# Altium schematic sheet CANTRICK PERIPHERAL.SchDoc
size A4; SheetNumber: 5; SheetTotal: 5
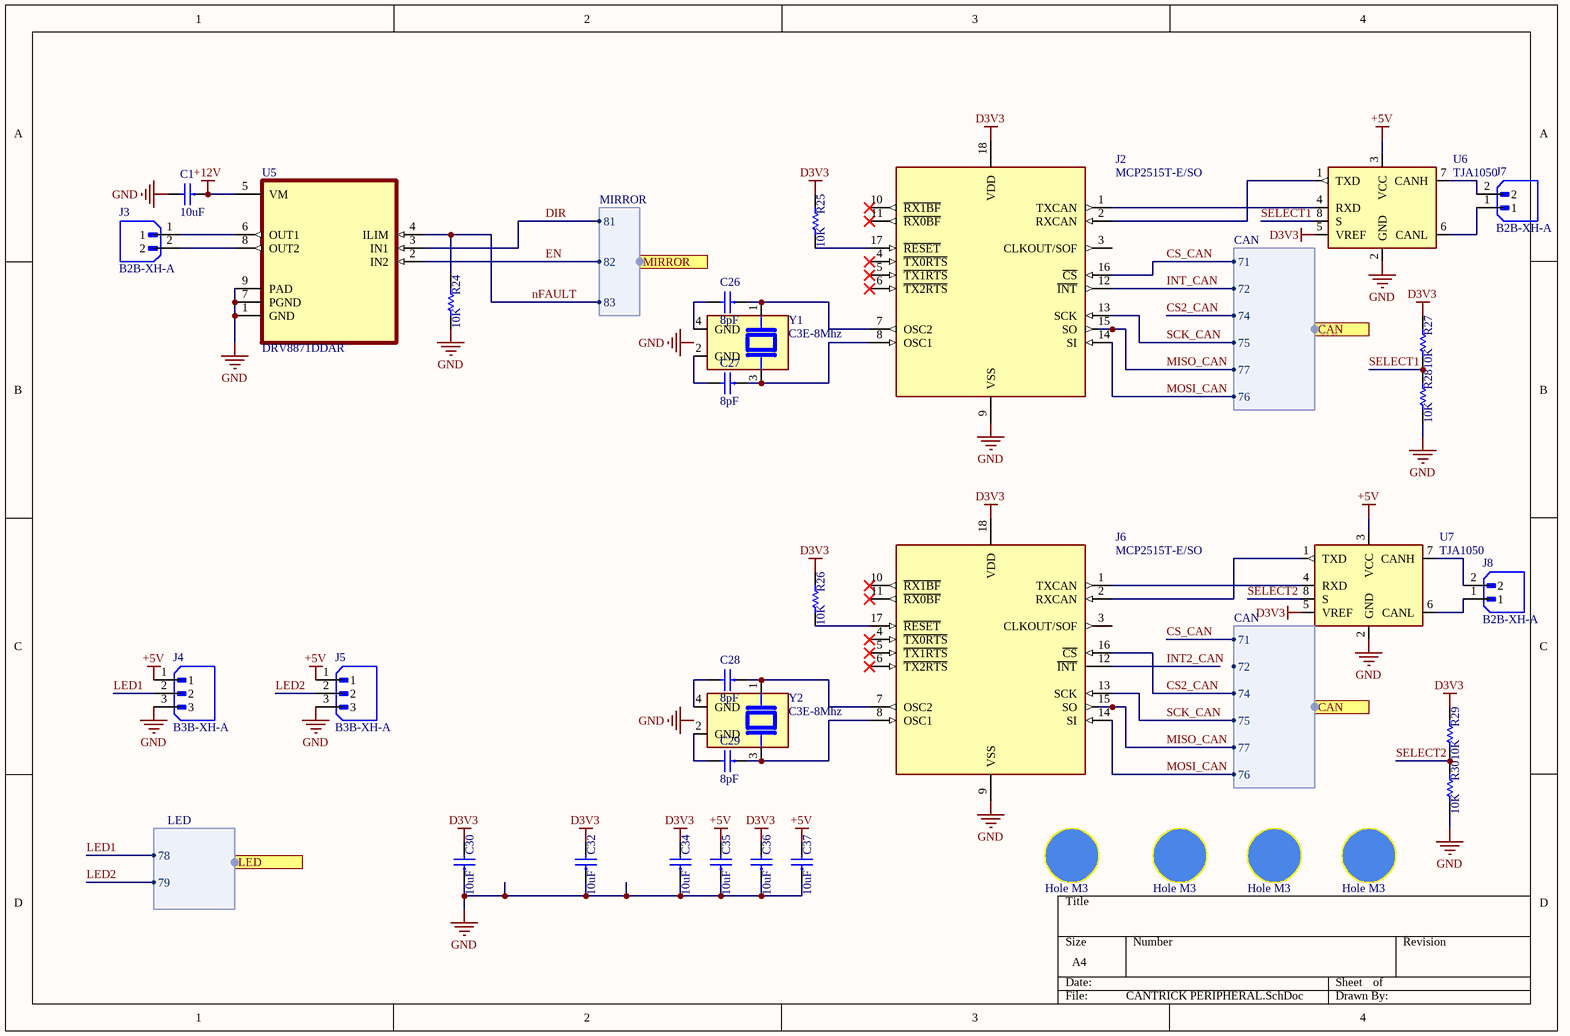
[diagram p0: CANTRICK PERIPHERAL.SchDoc]

## Parts
*1  Hole M3  [M3]
*2  Hole M3  [M3]
*3  Hole M3  [M3]
*4  Hole M3  [M3]
C1  10uF  [CAP-CER0603-0.8H]
C26  8pF  [CAP-CER0402-0.5H]
C27  8pF  [CAP-CER0402-0.5H]
C28  8pF  [CAP-CER0402-0.5H]
C29  8pF  [CAP-CER0402-0.5H]
C30  10uF  [CAP-CER0603-0.8H]
C32  10uF  [CAP-CER0603-0.8H]
C34  10uF  [CAP-CER0603-0.8H]
C35  10uF  [CAP-CER0603-0.8H]
C36  10uF  [CAP-CER0603-0.8H]
C37  10uF  [CAP-CER0603-0.8H]
J2  MCP2515T-E/SO  [SOIC127P1030X265-18N]
J3  B2B-XH-A  [JST_B2B-XH-A]
J4  B3B-XH-A  [JST_B3B-XH-A]
J5  B3B-XH-A  [JST_B3B-XH-A]
J6  MCP2515T-E/SO  [SOIC127P1030X265-18N]
J7  B2B-XH-A  [JST_B2B-XH-A]
J8  B2B-XH-A  [JST_B2B-XH-A]
R24  10K  [Res 0603]
R25  10K  [Res 0603]
R26  10K  [Res 0603]
R27  10K  [Res 0603]
R28  10K  [Res 0603]
R29  10K  [Res 0603]
R30  10K  [Res 0603]
U5  DRV8871DDAR  [VREG_LM5017MR/NOPB]
U6  TJA1050  [SOT96-1]
U7  TJA1050  [SOT96-1]
Y1  C3E-8Mhz  [XTAL_C3E-8.000-8-1015-R]
Y2  C3E-8Mhz  [XTAL_C3E-8.000-8-1015-R]

## Ports
CAN (harness CAN), LED (harness LED), MIRROR (harness MIRROR)

## Harnesses
CAN: 71, 72, 74, 75, 76, 77
LED: 78, 79
MIRROR: 81, 82, 83

## Nets
+5V: C35.2 C37.2 J4.1 J5.1 U6.3(VCC) U7.3(VCC)
+12V: C1.1 U5.5(VM)
D3V3: C30.2 C32.2 C34.2 C36.2 J2.18(VDD) J6.18(VDD) R25.2 R26.2 R27.2 R29.2 U6.5(VREF) U7.5(VREF)
GND: C1.2 C30.1 C32.1 C34.1 C35.1 C36.1 C37.1 J2.9(VSS) J4.3 J5.3 J6.9(VSS) R24.1 R28.1 R30.1 U5.1(GND) U5.7(PGND) U5.9(PAD) U6.2(GND) U7.2(GND)
CS2_CAN: J6.16(~{CS}) ; port CAN.74
CS_CAN: J2.16(~{CS}) ; port CAN.71
DIR: U5.3(IN1) ; port MIRROR.81
EN: U5.2(IN2) ; port MIRROR.82
INT2_CAN: J6.12(~{INT})
INT_CAN: J2.12(~{INT}) ; port CAN.72
LED1: J4.2 ; port LED.78
LED2: J5.2 ; port LED.79
MISO_CAN: J2.15(SO) J6.15(SO) ; port CAN.77
MOSI_CAN: J2.14(SI) J6.14(SI) ; port CAN.76
nFAULT: R24.2 U5.4(ILIM) ; port MIRROR.83
SCK_CAN: J2.13(SCK) J6.13(SCK) ; port CAN.75
SELECT1: R27.1 R28.2 U6.8(S)
SELECT2: R29.1 R30.2 U7.8(S)
NetC26_1: C26.1 J2.7(OSC2) Y1.1
NetC26_2: C26.2 Y1.4(GND)
NetC27_1: C27.1 J2.8(OSC1) Y1.3
NetC27_2: C27.2 Y1.2(GND)
NetC28_1: C28.1 J6.7(OSC2) Y2.1
NetC28_2: C28.2 Y2.4(GND)
NetC29_1: C29.1 J6.8(OSC1) Y2.3
NetC29_2: C29.2 Y2.2(GND)
NetJ2_1: J2.1(TXCAN) U6.4(RXD)
NetJ2_2: J2.2(RXCAN) U6.1(TXD)
NetJ2_17: J2.17(~{RESET}) R25.1
NetJ3_1: J3.1 U5.6(OUT1)
NetJ3_2: J3.2 U5.8(OUT2)
NetJ6_1: J6.1(TXCAN) U7.4(RXD)
NetJ6_2: J6.2(RXCAN) U7.1(TXD)
NetJ6_17: J6.17(~{RESET}) R26.1
NetJ7_1: J7.1 U6.6(CANL)
NetJ7_2: J7.2 U6.7(CANH)
NetJ8_1: J8.1 U7.6(CANL)
NetJ8_2: J8.2 U7.7(CANH)

Not connected (* = marked no-connect by the designer): J2 3(CLKOUT/SOF) 4(~{TX0RTS})* 5(~{TX1RTS})* 6(~{TX2RTS})* 10(~{RX1BF})* 11(~{RX0BF})*; J6 3(CLKOUT/SOF) 4(~{TX0RTS})* 5(~{TX1RTS})* 6(~{TX2RTS})* 10(~{RX1BF})* 11(~{RX0BF})*

## Notes on the sheet
- Labels drawn without touching a wire or pin: GND

## Library data of the parts
C1 C30 C32 C34-C37 = CAPCER0001 100nF 10% 50V X7R 0603 SMD: CAP CER 100nF 10% 50V X7R 0603 SMD; LINE: SMT; TYPE: EP; UNIT: PCS; TMG CODE: None; CERTIFICATION: NA; CLASS: B; MOUNT: SMD; TMG PN: CAPCER0001; ComponentLink1Description: Datasheet; ComponentLink1URL: https://datasheet.lcsc.com/lcsc/1811021431_Samsung-Electro-Mechanics-CL10B104KB8NNNC_C1591.pdf; Footprint: 0603
C26-C29 = CAPCER0013 100nF 10% 50V X7R 0402 SMD: CAP CER 100nF 10% 50V X7R 0402 SMD; LINE: SMT; TYPE: EP; UNIT: PCS; TMG CODE: None; CERTIFICATION: NA; CLASS: B; MOUNT: SMD; TMG PN: CAPCER0013; ComponentLink1Description: Datasheet; ComponentLink1URL: https://datasheet.lcsc.com/lcsc/1811021431_Samsung-Electro-Mechanics-CL10B104KB8NNNC_C1591.pdf; Footprint: 0402
J2 J6 = MCP2515T-E/SO: CAN controller w/ SPI interface, 125 deg C18 SOIC .300in T/R | Microchip Technology Inc. MCP2515T-E/SO; SnapEDA_Link: https://www.snapeda.com/parts/MCP2515T-E/SO/Microchip/view-part/?ref=snap; Package: SOIC-18 Microchip; Value: *; MF: Microchip; MP: MCP2515T-E/SO; Check_prices: https://www.snapeda.com/parts/MCP2515T-E/SO/Microchip/view-part/?ref=eda
J3 J7 J8 = B2B-XH-A: MF: {'manufacturer': u'JST Sales America Inc.'}; Package: None; Price: None; Value: *; MP: B2B-XH-A; Availability: Unavailable
J4 J5 = B3B-XH-A: Connector Header Through Hole 3 position 0.098 (2.50mm); MF: JST Sales; SnapEDA_Link: https://www.snapeda.com/parts/B3B-XH-A/JST+Sales+America+Inc./view-part/?ref=snap; Package: None; Value: *; MP: B3B-XH-A; Check_prices: https://www.snapeda.com/parts/B3B-XH-A/JST+Sales+America+Inc./view-part/?ref=eda
R24-R30 = Resistor 2.2K: Res Thick Film 0603 2.2K Ohm 5% 1/10W ±200ppm/°C Molded SMD SMD Paper T/R; Manufacturer: Vishay; Manufacturer Part Number: CRCW06032K20JNEA; Resistance: 2.2kR; Power Rating: 100mW; Voltage Rating: 75V; Supplier 1: Arrow Electronics; RoHS: Yes; Category: Chip SMD Resistors; Stock 1: 130000; Pricing 1: 5000=0.0053 (USD); Case/Package: 0603; Weight: 7.1E-05oz; Case Code (Metric): 1608; Case Code (Imperial): 0603; Contact Plating: Tin; Size Code: 0603; Min Operating Temperature: -55°C; Max Operating Temperature: 155°C; Package Quantity: 5000; Tolerance: 5%; Packaging: Tape and Reel; Resistor Type: Thick Film; Number of Terminations: 2; Temperature Coefficient: 200ppm/°C; Termination: SMD/SMT; Max Power Dissipation: 100mW; Features: Automotive AEC-Q200; Series: CRCW; Resistance Tolerance: 5%; Construction: Rectangular; Length: 1.55mm; Width: 0.85mm; Height: 0.45mm; Depth: 0.85mm; Ratings: AEC-Q200; Radiation Hardening: No; Military Standard: Not; RoHS Compliant: Yes; Reach SVHC Compliant: Unknown; Lead Free: 5697LeadFree; ComponentLink1URL: https://datasheet.ciiva.com/2462/dcrcwe3-2462048.pdf?src-supplier=Digikey; ComponentLink1Description: https://datasheet.ciiva.com/2462/dcrcwe3-2462048.pdf?src-supplier=Digikey; ComponentLink2URL: https://datasheet.ciiva.com/16767/70201119-16767464.pdf?src-supplier=Allied+Electronics; ComponentLink2Description: https://datasheet.ciiva.com/16767/70201119-16767464.pdf?src-supplier=Allied+Electronics; ComponentLink3URL: https://datasheet.ciiva.com/2462/dcrcwe3-2462046.pdf?src-supplier=Digikey; ComponentLink3Description: https://datasheet.ciiva.com/2462/dcrcwe3-2462046.pdf?src-supplier=Digikey; ComponentLink4URL: https://datasheet.ciiva.com/5541/dcrcwe3-109170-5541959.pdf?src-supplier=Mouser; ComponentLink4Description: https://datasheet.ciiva.com/5541/dcrcwe3-109170-5541959.pdf?src-supplier=Mouser; ComponentLink5URL: https://datasheet.ciiva.com/16286/dcrcwe3-16286997.pdf?src-supplier=Future+Electronics; ComponentLink5Description: https://datasheet.ciiva.com/16286/dcrcwe3-16286997.pdf?src-supplier=Future+Electronics; Supplier Part Number 1: CRCW06032K20JNEA
U5 = DRV8871DDAR: 50-V, 3.6-A H-bridge motor driver with integrated current sensing; MF: Texas Instruments; SnapEDA_Link: https://www.snapeda.com/parts/DRV8871DDAR/Texas+Instruments/view-part/?ref=snap; Package: HSOIC-8 Texas Instruments; Value: *; MP: DRV8871DDAR; Check_prices: https://www.snapeda.com/parts/DRV8871DDAR/Texas+Instruments/view-part/?ref=eda
U6 U7 = TJA1050: CAN 1MBd Silent 5V Automotive 8-Pin SO T/R; MF: NXP Semiconductors; SnapEDA_Link: https://www.snapeda.com/parts/TJA1050/NXP+Semiconductors/view-part/?ref=snap; Package: None; Value: *; MP: TJA1050; Check_prices: https://www.snapeda.com/parts/TJA1050/NXP+Semiconductors/view-part/?ref=eda
Y1 Y2 = C3E-8.000-8-1015-R: Package: None; Price: None; Value: *; MP: C3E-8.000-8-1015-R; Availability: Unavailable